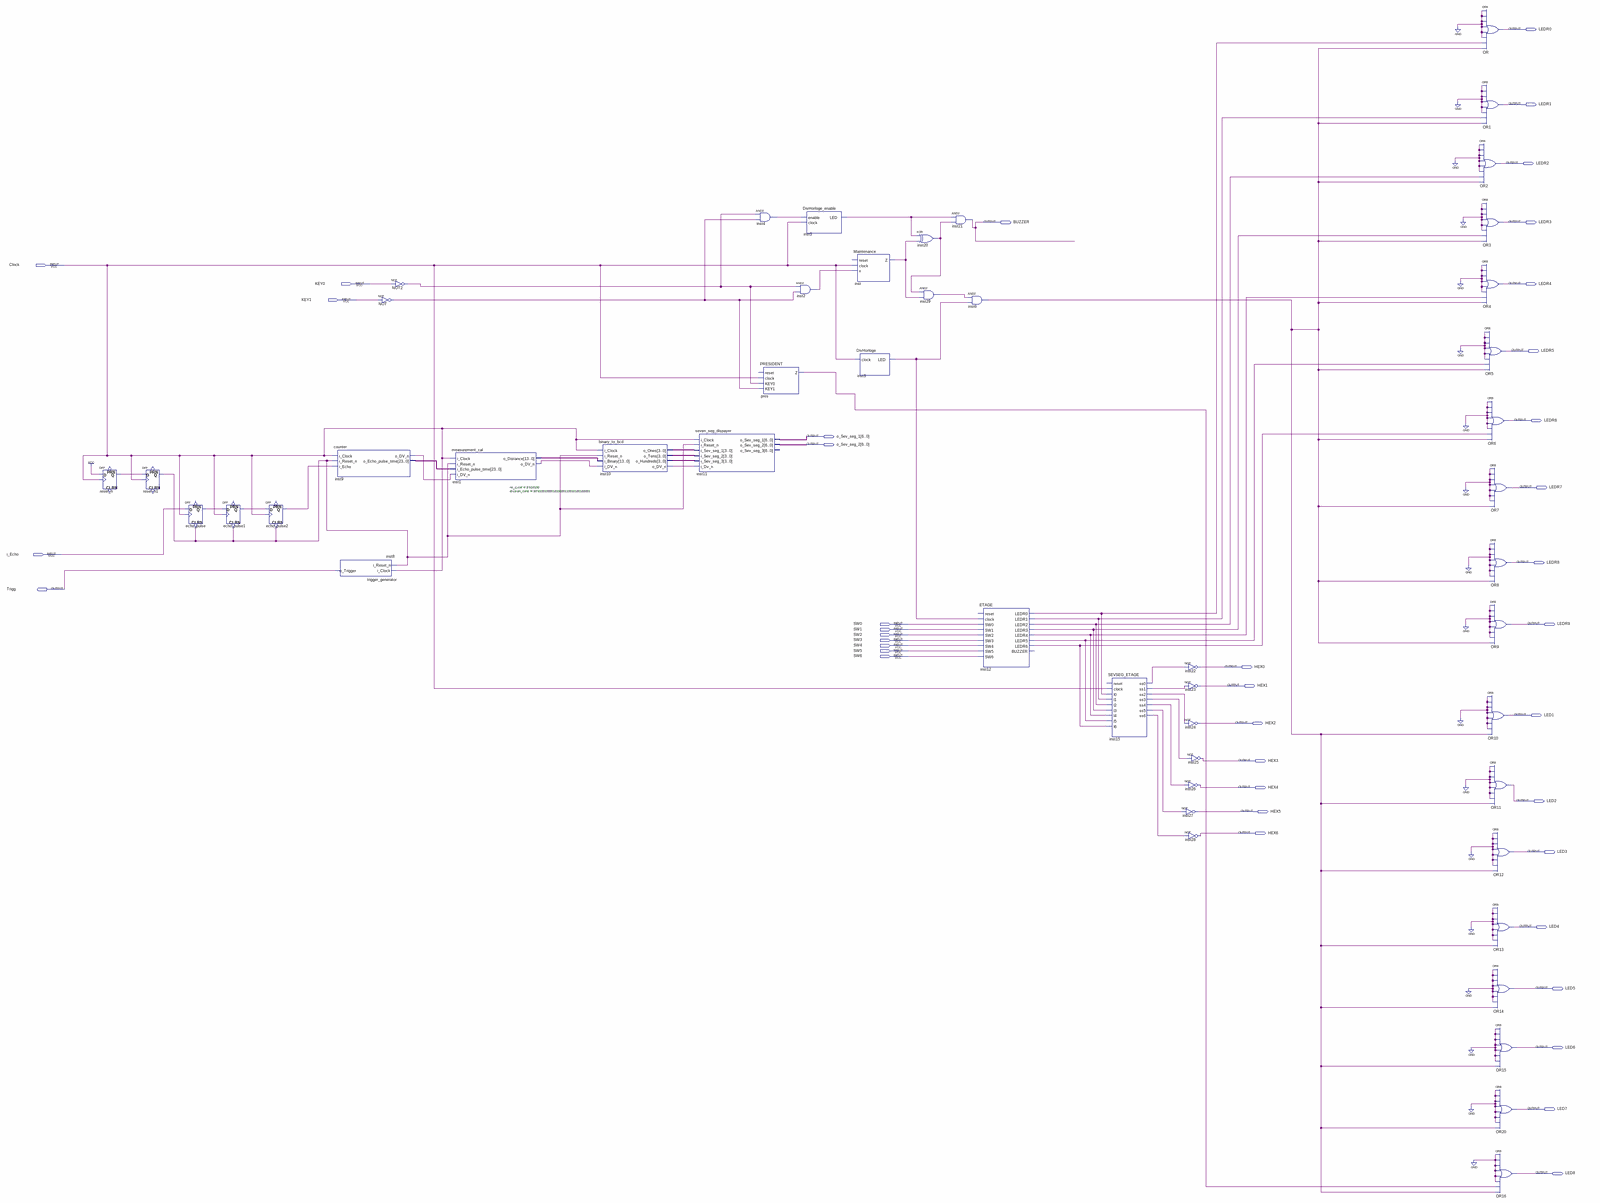
[diagram p0: schematic sheet, whole]
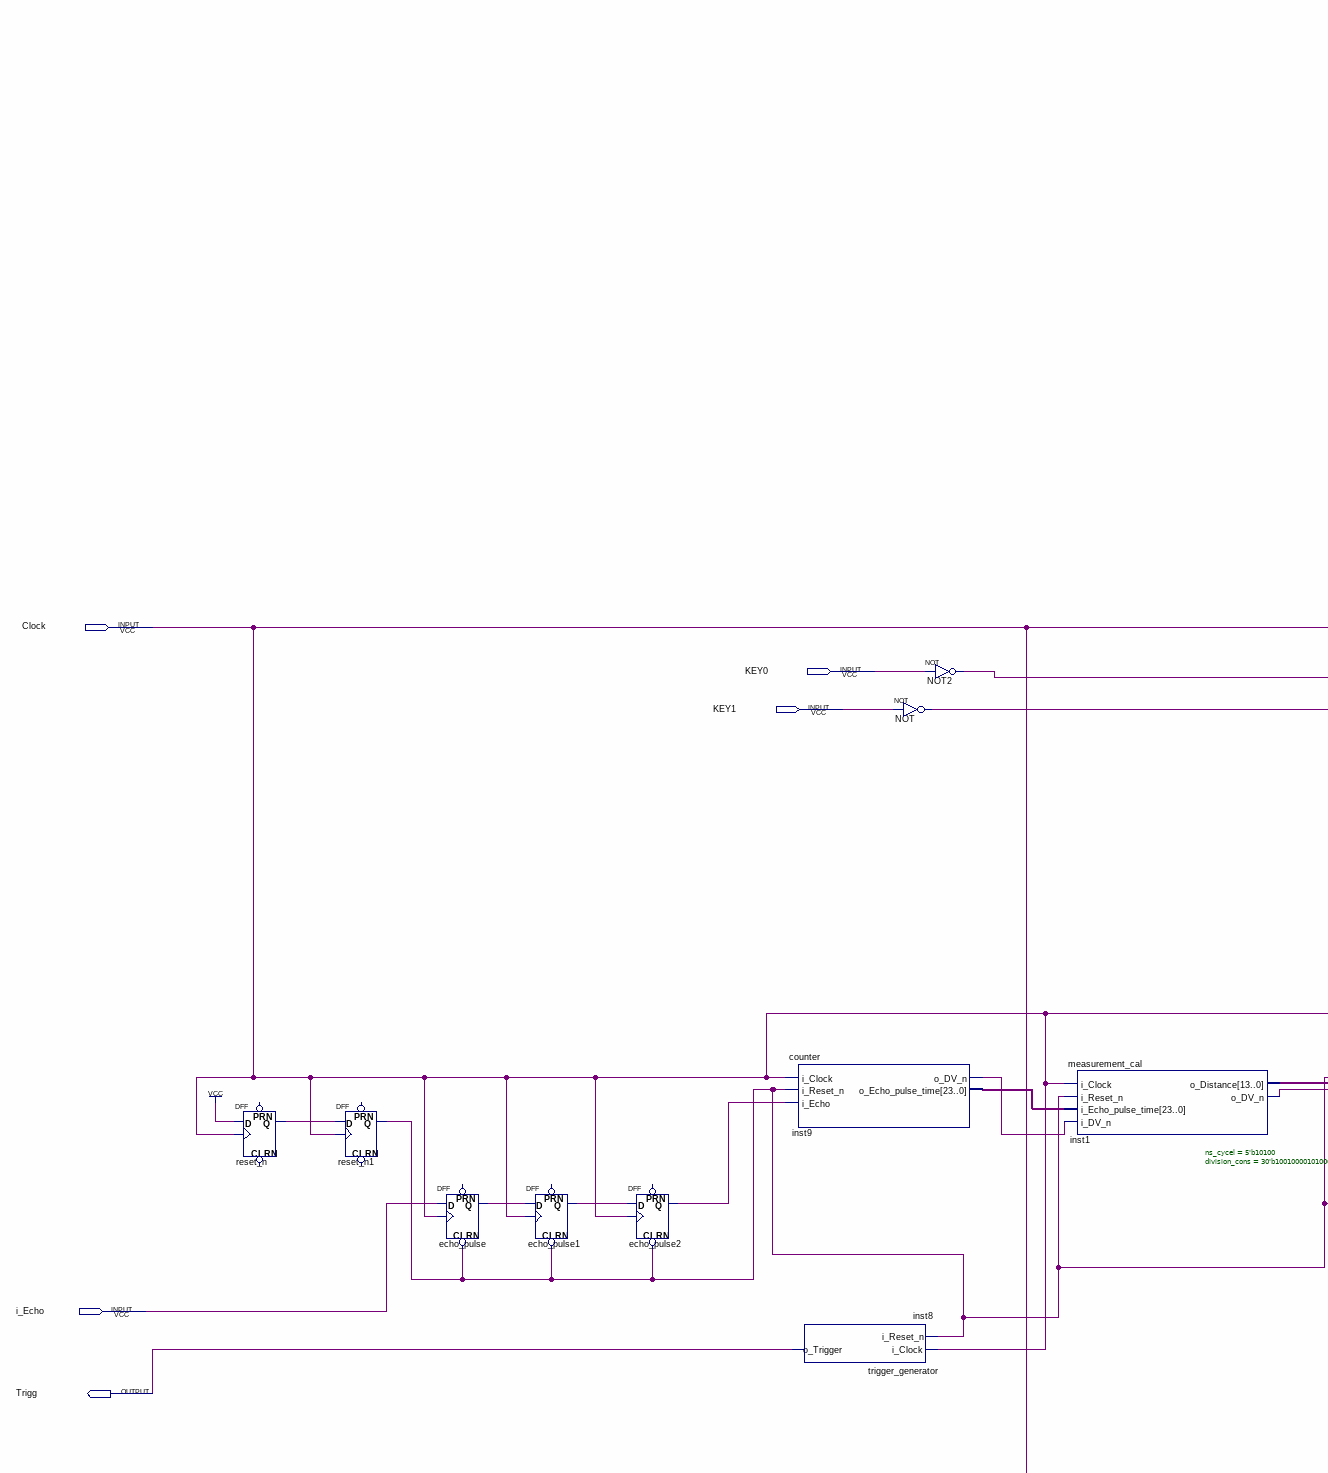
[diagram p1: schematic sheet, upper left part]
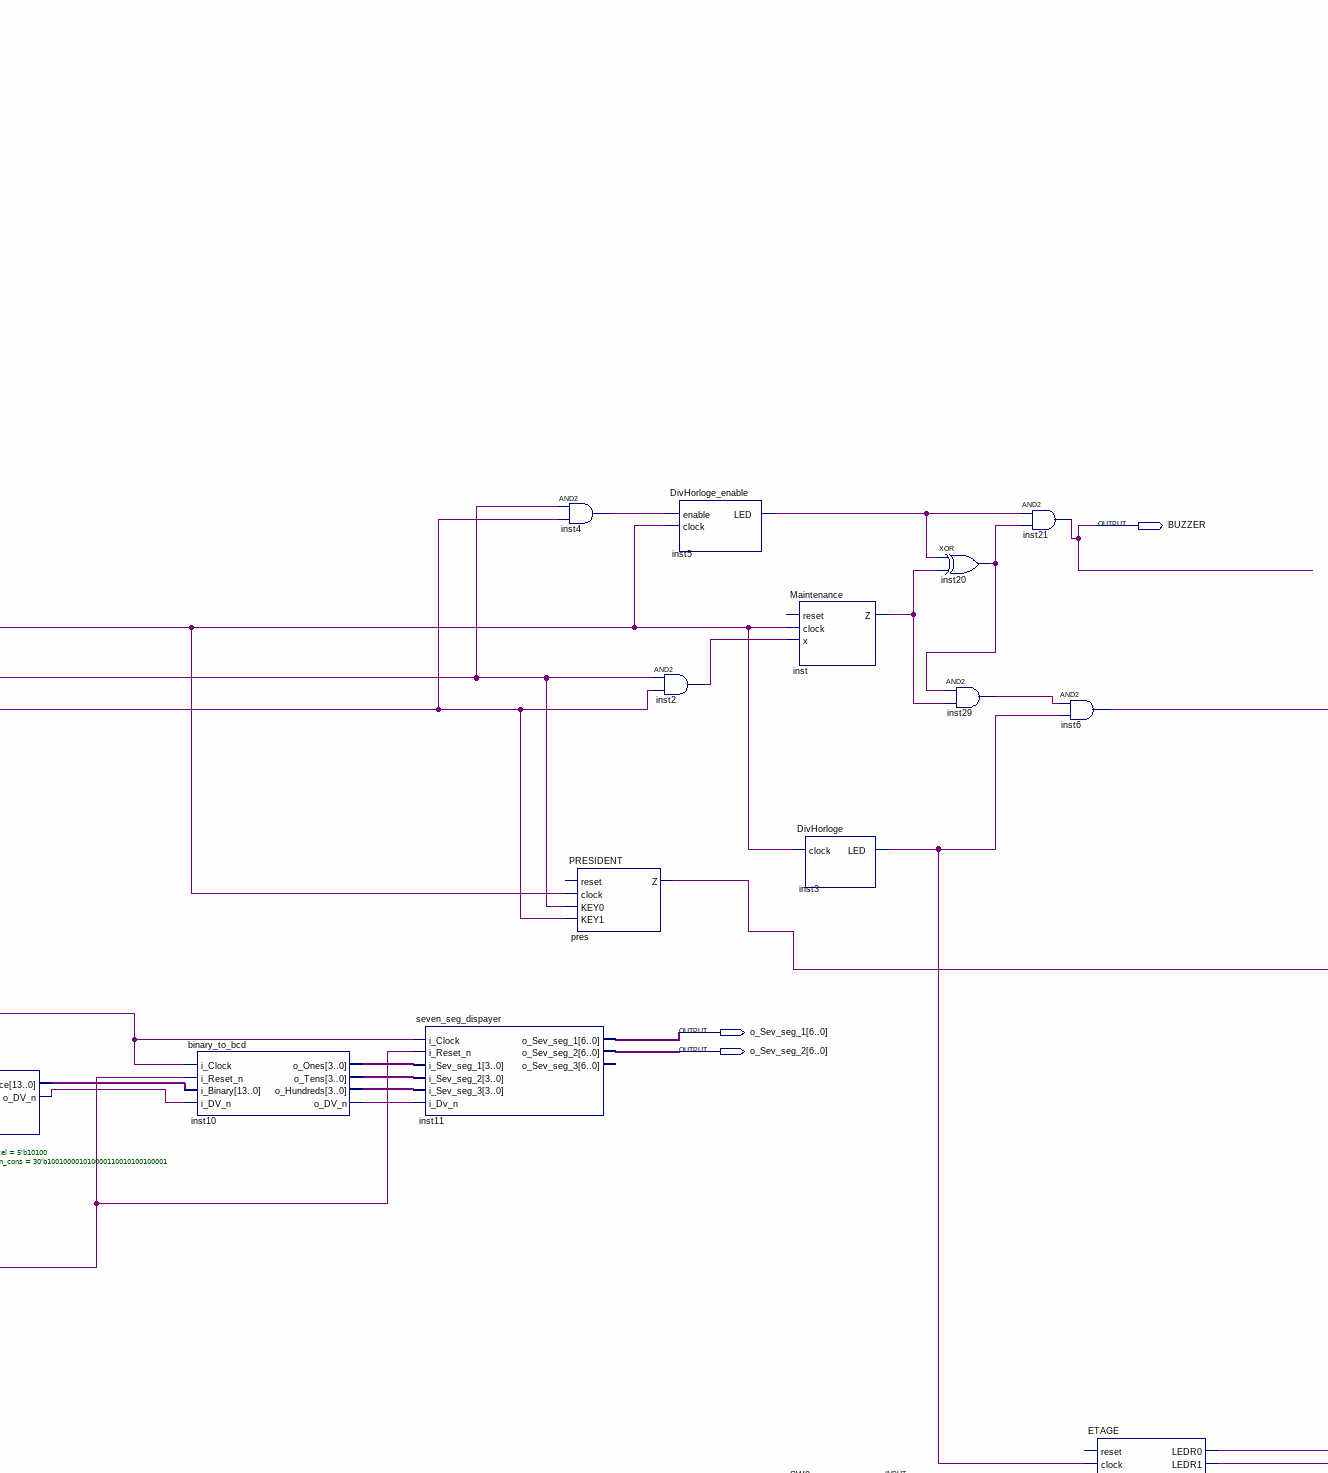
[diagram p2: schematic sheet, upper centre part]
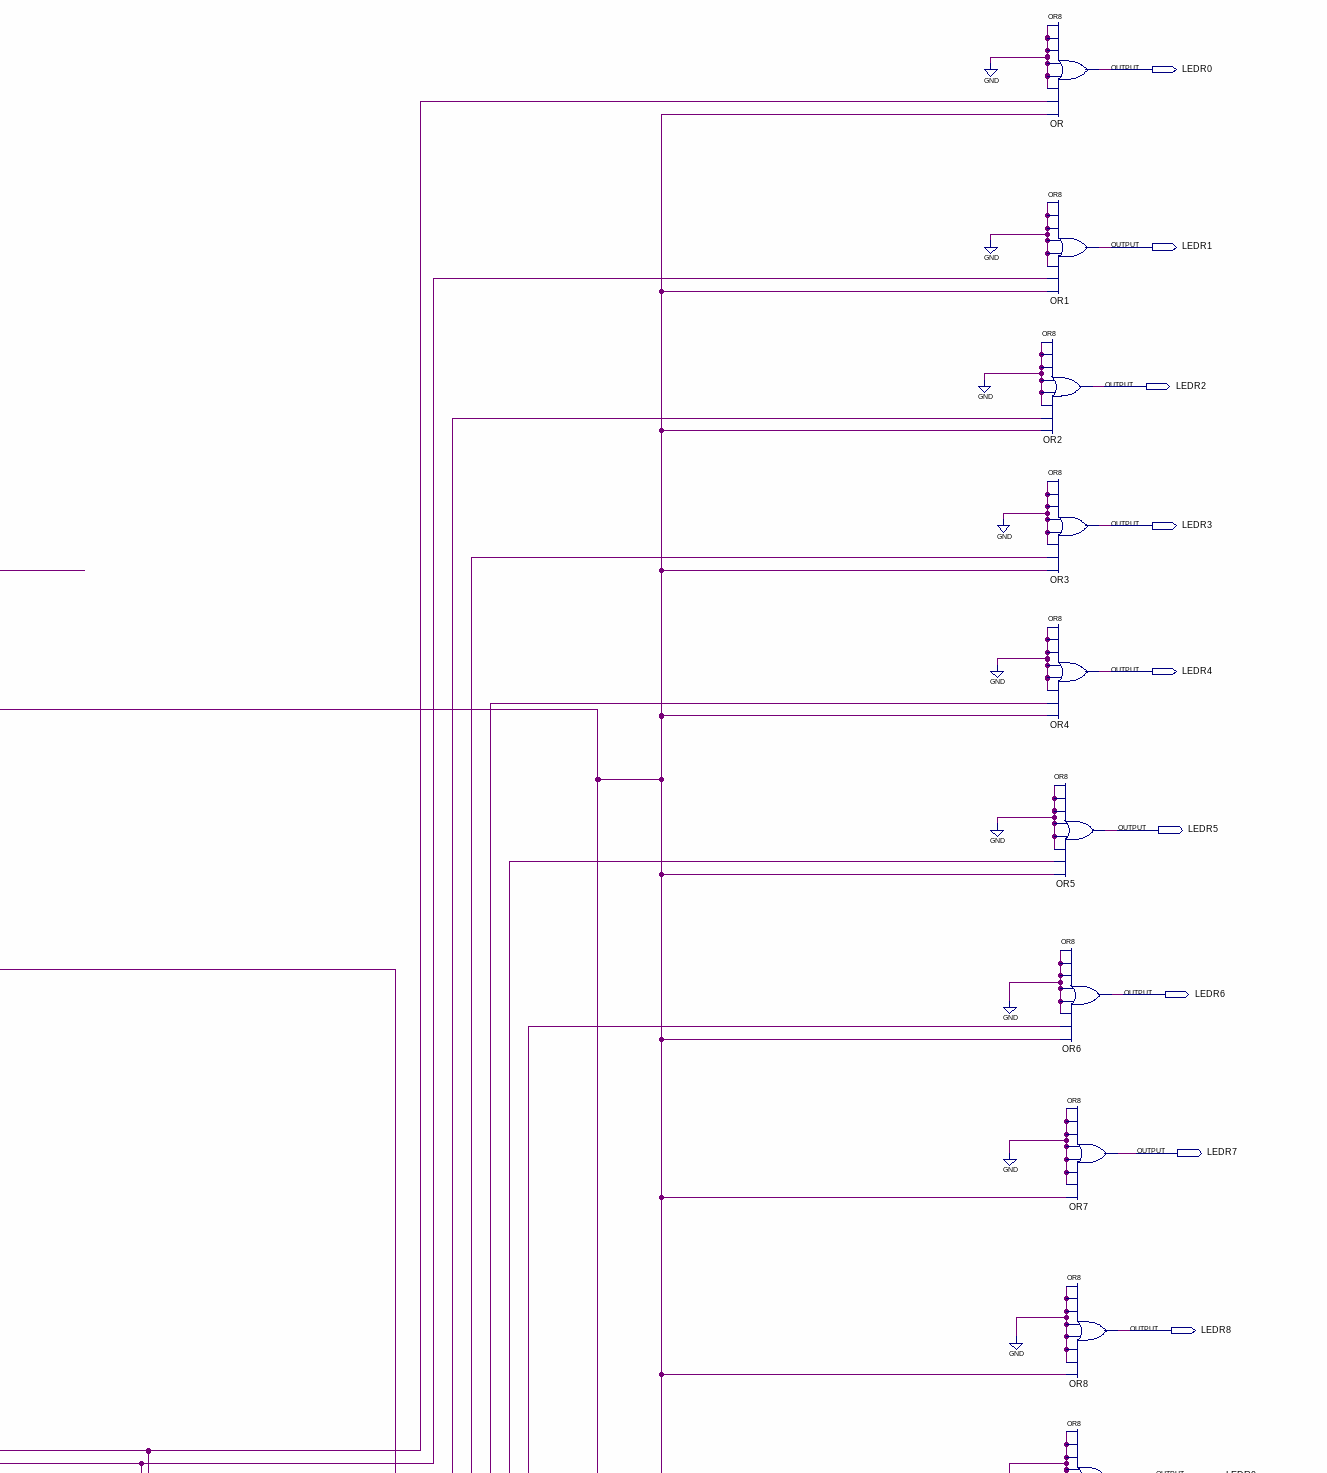
[diagram p3: schematic sheet, upper right part]
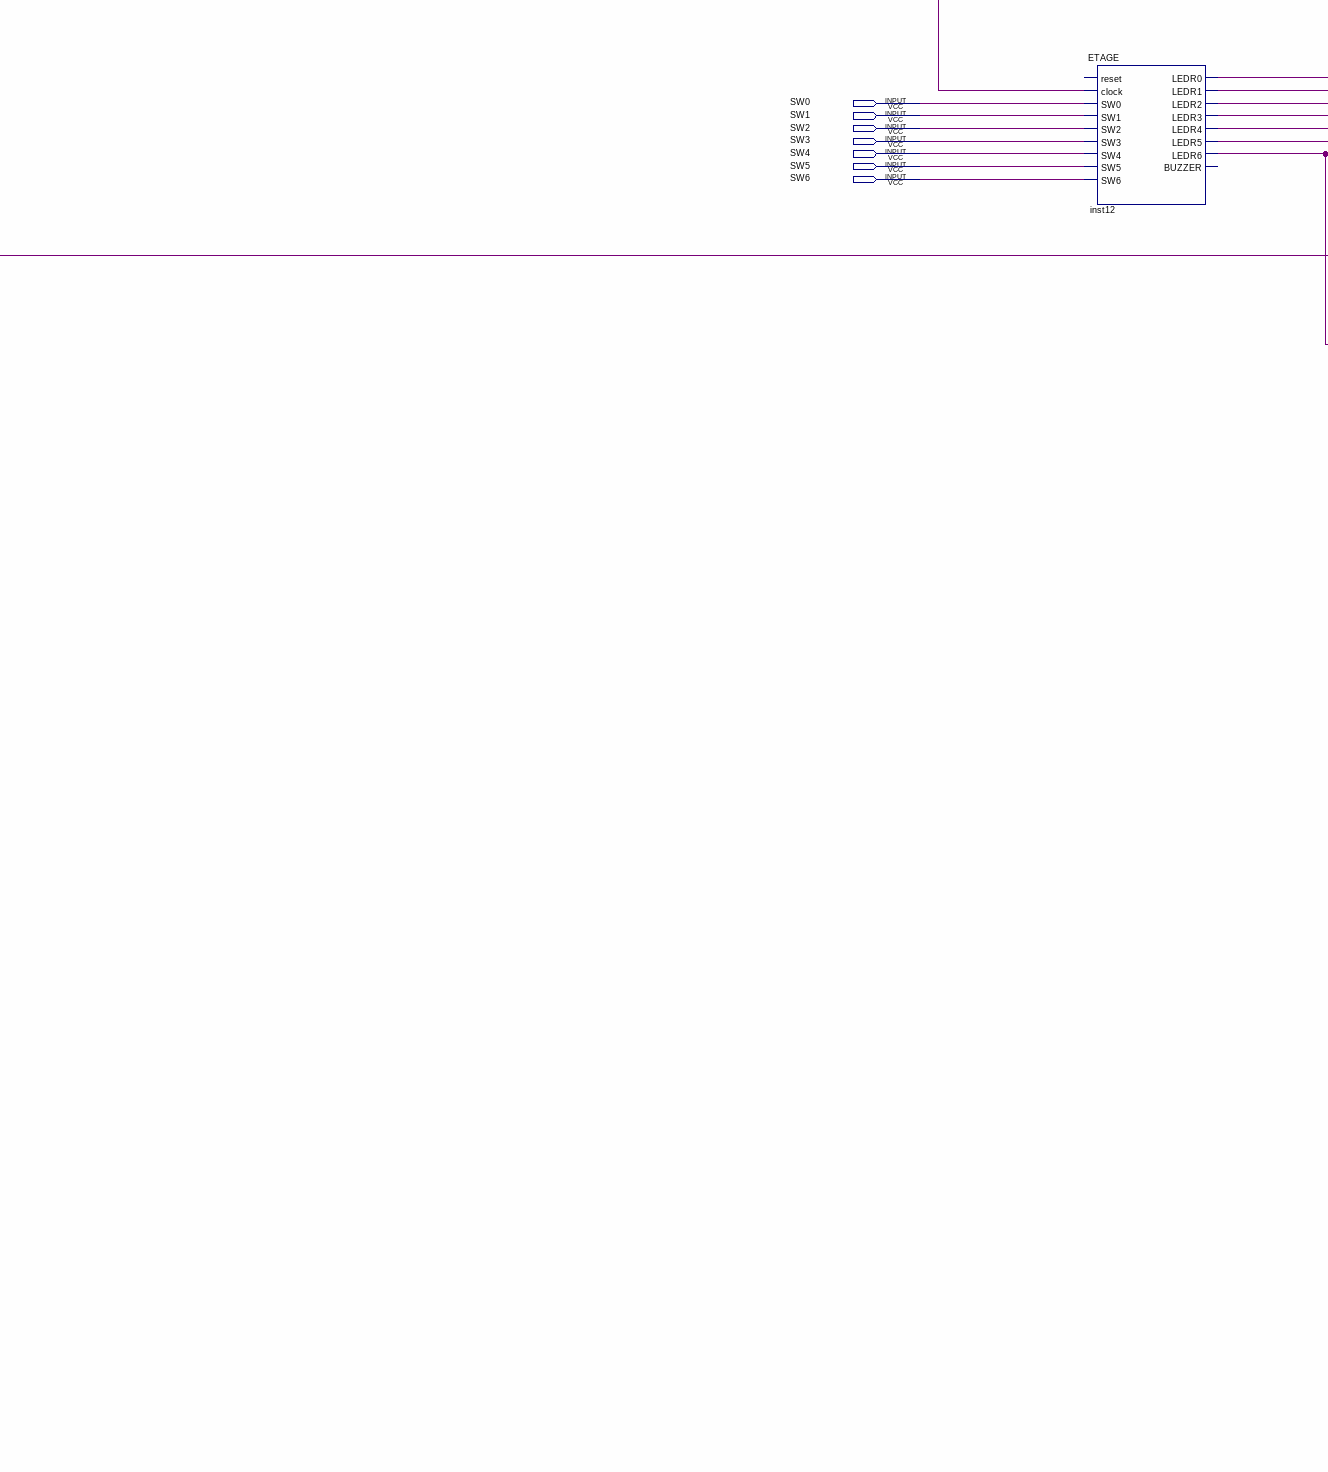
[diagram p4: schematic sheet, lower centre part]
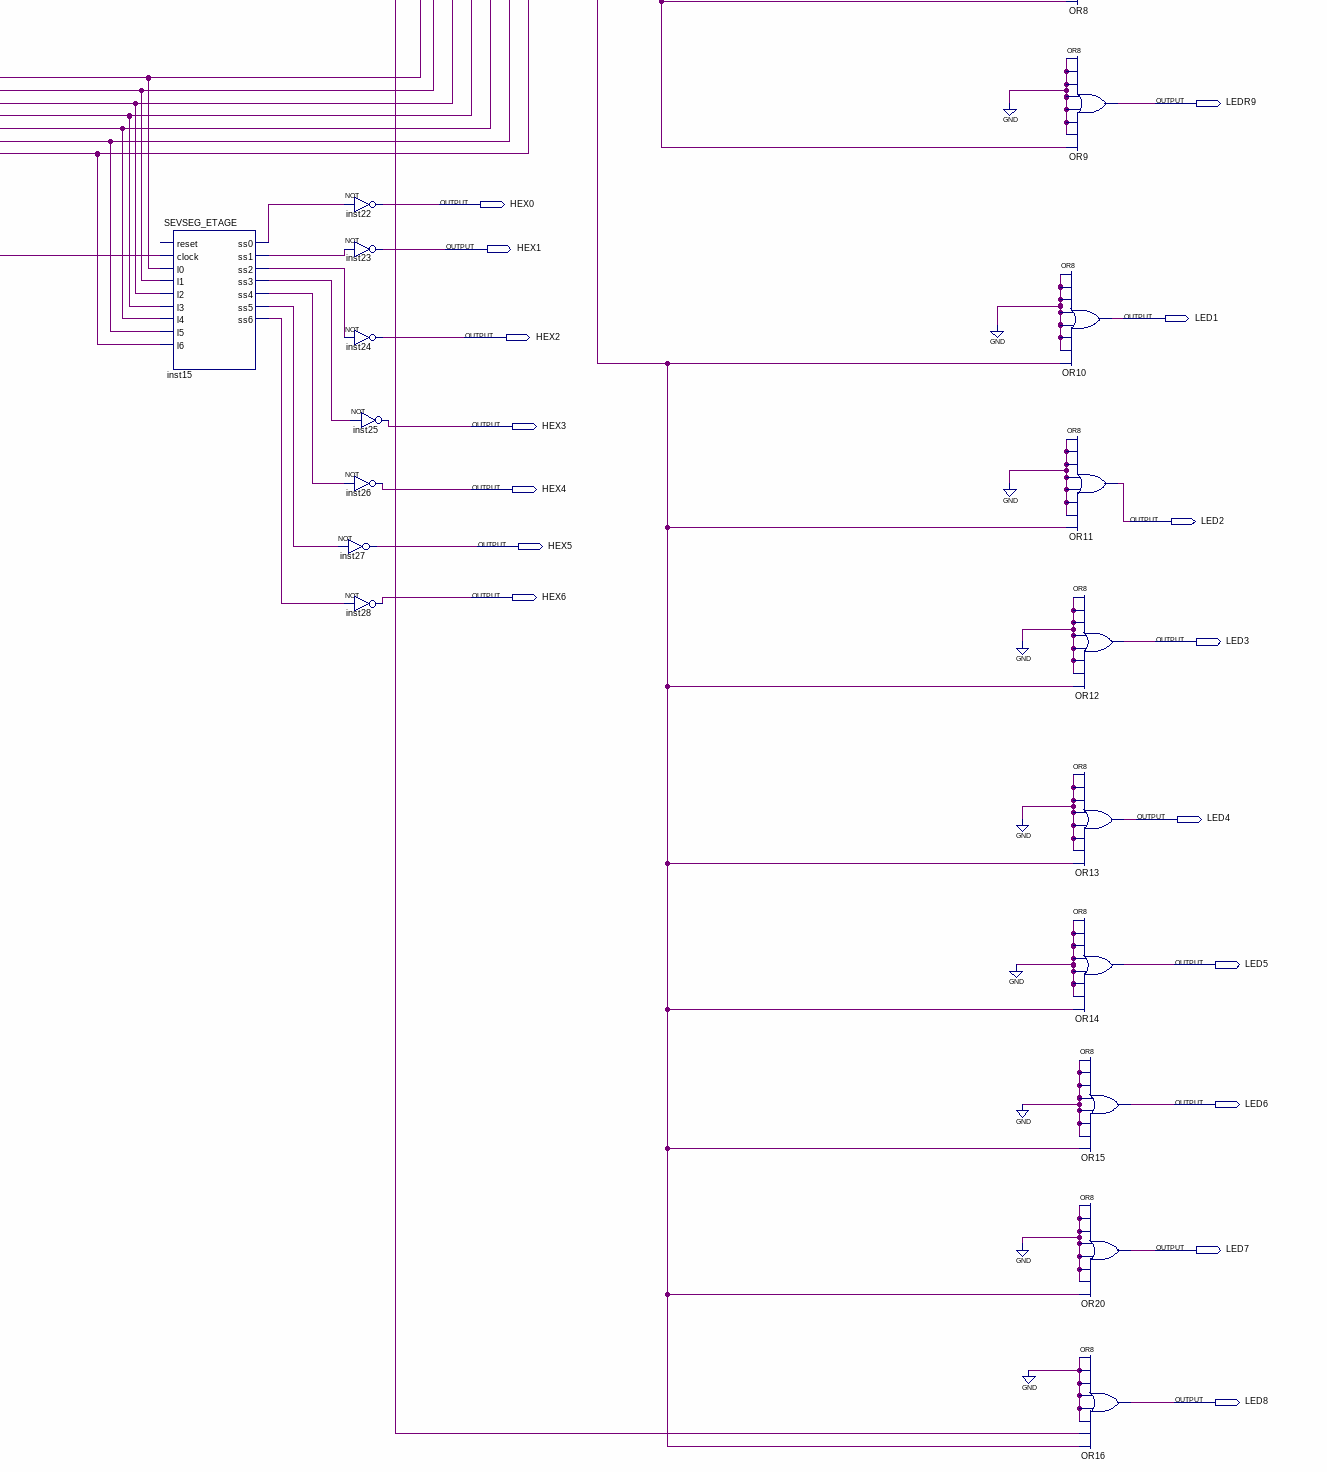
[diagram p5: schematic sheet, lower right part]
// Quartus schematic Quartus Robin.bdf as structural Verilog: 49 symbols, 40 pins
module \Quartus_Robin  (
  input  Clock,
  input  KEY0,
  input  KEY1,
  input  i_Echo,
  input  SW0,
  input  SW1,
  input  SW2,
  input  SW3,
  input  SW4,
  input  SW5,
  input  SW6,
  output LEDR0,
  output LEDR1,
  output LEDR2,
  output BUZZER,
  output LEDR3,
  output LEDR4,
  output LEDR5,
  output LEDR6,
  output [6:0] o_Sev_seg_1,
  output [6:0] o_Sev_seg_2,
  output LEDR7,
  output LEDR8,
  output Trigg,
  output LEDR9,
  output HEX0,
  output HEX1,
  output LED1,
  output HEX2,
  output HEX3,
  output HEX4,
  output LED2,
  output HEX5,
  output HEX6,
  output LED3,
  output LED4,
  output LED5,
  output LED6,
  output LED7,
  output LED8
);

  wire echo_pulse1_q, echo_pulse2_q, echo_pulse_q, inst1_o_dv_n, inst2_out, inst3_led, inst4_out, inst5_led,
       inst6_out, inst9_o_dv_n, inst10_o_dv_n, inst12_ledr0, inst12_ledr1, inst12_ledr2, inst12_ledr3,
       inst12_ledr4, inst12_ledr5, inst12_ledr6, inst15_ss0, inst15_ss1, inst15_ss2, inst15_ss3, inst15_ss4,
       inst15_ss5, inst15_ss6, inst20_out, inst29_out, inst_z, NOT2_out, NOT_out, pres_z, reset_n1_q,
       reset_n_q;
  wire [3:0] inst10_o_hundreds, inst10_o_ones, inst10_o_tens;
  wire [13:0] inst1_o_distance;
  wire [23:0] inst9_o_echo_pulse_time;

  DFF reset_n (.CLK(Clock), .D(1'b1), .Q(reset_n_q));  // open: CLRN, PRN
  DFF reset_n1 (.CLK(Clock), .D(reset_n_q), .Q(reset_n1_q));  // open: CLRN, PRN
  DFF echo_pulse (.CLRN(reset_n1_q), .CLK(Clock), .D(i_Echo), .Q(echo_pulse_q));  // open: PRN
  DFF echo_pulse1 (.CLRN(reset_n1_q), .CLK(Clock), .D(echo_pulse_q), .Q(echo_pulse1_q));  // open: PRN
  DFF echo_pulse2 (.CLRN(reset_n1_q), .CLK(Clock), .D(echo_pulse1_q), .Q(echo_pulse2_q));  // open: PRN
  counter inst9 (
    .i_Clock(Clock), .i_Reset_n(reset_n1_q), .i_Echo(echo_pulse2_q), .o_DV_n(inst9_o_dv_n),
    .o_Echo_pulse_time(inst9_o_echo_pulse_time));
  trigger_generator inst8 (.i_Clock(Clock), .i_Reset_n(reset_n1_q), .o_Trigger(Trigg));
  not NOT (NOT_out, KEY1);
  not NOT2 (NOT2_out, KEY0);
  measurement_cal #(.ns_cycel(5'b10100), .division_cons(30'b100100001010000110010100100001)) inst1 (
    .i_Clock(Clock), .i_Reset_n(reset_n1_q), .i_Echo_pulse_time(inst9_o_echo_pulse_time),
    .i_DV_n(inst9_o_dv_n), .o_Distance(inst1_o_distance), .o_DV_n(inst1_o_dv_n));
  binary_to_bcd inst10 (
    .i_Clock(Clock), .i_Reset_n(reset_n1_q), .i_Binary(inst1_o_distance), .i_DV_n(inst1_o_dv_n),
    .o_Ones(inst10_o_ones), .o_Tens(inst10_o_tens), .o_Hundreds(inst10_o_hundreds), .o_DV_n(inst10_o_dv_n));
  seven_seg_dispayer inst11 (
    .i_Clock(Clock), .i_Reset_n(reset_n1_q), .i_Sev_seg_1(inst10_o_ones), .i_Sev_seg_2(inst10_o_tens),
    .i_Sev_seg_3(inst10_o_hundreds), .i_Dv_n(inst10_o_dv_n), .o_Sev_seg_1(o_Sev_seg_1),
    .o_Sev_seg_2(o_Sev_seg_2));  // open: o_Sev_seg_3
  and inst4 (inst4_out, NOT2_out, NOT_out);
  PRESIDENT pres (.clock(Clock), .KEY0(NOT2_out), .KEY1(NOT_out), .Z(pres_z));  // open: reset
  DivHorloge_enable inst5 (.enable(inst4_out), .clock(Clock), .LED(inst5_led));
  and inst2 (inst2_out, NOT2_out, NOT_out);
  Maintenance inst (.clock(Clock), .x(inst2_out), .Z(inst_z));  // open: reset
  DivHorloge inst3 (.clock(Clock), .LED(inst3_led));
  xor inst20 (inst20_out, inst5_led, inst_z);
  and inst29 (inst29_out, inst20_out, inst_z);
  and inst21 (BUZZER, inst5_led, inst20_out);
  and inst6 (inst6_out, inst29_out, inst3_led);
  ETAGE inst12 (
    .clock(inst3_led), .SW0(SW0), .SW1(SW1), .SW2(SW2), .SW3(SW3), .SW4(SW4), .SW5(SW5), .SW6(SW6),
    .LEDR0(inst12_ledr0), .LEDR1(inst12_ledr1), .LEDR2(inst12_ledr2), .LEDR3(inst12_ledr3),
    .LEDR4(inst12_ledr4), .LEDR5(inst12_ledr5), .LEDR6(inst12_ledr6));  // open: reset, BUZZER
  SEVSEG_ETAGE inst15 (
    .clock(Clock), .l0(inst12_ledr0), .l1(inst12_ledr1), .l2(inst12_ledr2), .l3(inst12_ledr3),
    .l4(inst12_ledr4), .l5(inst12_ledr5), .l6(inst12_ledr6), .ss0(inst15_ss0), .ss1(inst15_ss1),
    .ss2(inst15_ss2), .ss3(inst15_ss3), .ss4(inst15_ss4), .ss5(inst15_ss5), .ss6(inst15_ss6));  // open: reset
  not inst22 (HEX0, inst15_ss0);
  not inst23 (HEX1, inst15_ss1);
  not inst24 (HEX2, inst15_ss2);
  not inst25 (HEX3, inst15_ss3);
  not inst26 (HEX4, inst15_ss4);
  not inst27 (HEX5, inst15_ss5);
  not inst28 (HEX6, inst15_ss6);
  or OR (LEDR0, 1'b0, 1'b0, 1'b0, 1'b0, 1'b0, 1'b0, inst12_ledr0, inst6_out);
  or OR1 (LEDR1, 1'b0, 1'b0, 1'b0, 1'b0, 1'b0, 1'b0, inst12_ledr1, inst6_out);
  or OR2 (LEDR2, 1'b0, 1'b0, 1'b0, 1'b0, 1'b0, 1'b0, inst12_ledr2, inst6_out);
  or OR3 (LEDR3, 1'b0, 1'b0, 1'b0, 1'b0, 1'b0, 1'b0, inst12_ledr3, inst6_out);
  or OR4 (LEDR4, 1'b0, 1'b0, 1'b0, 1'b0, 1'b0, 1'b0, inst12_ledr4, inst6_out);
  or OR5 (LEDR5, 1'b0, 1'b0, 1'b0, 1'b0, 1'b0, 1'b0, inst12_ledr5, inst6_out);
  or OR6 (LEDR6, 1'b0, 1'b0, 1'b0, 1'b0, 1'b0, 1'b0, inst12_ledr6, inst6_out);
  or OR7 (LEDR7, 1'b0, 1'b0, 1'b0, 1'b0, 1'b0, 1'b0, 1'b0, inst6_out);
  or OR8 (LEDR8, 1'b0, 1'b0, 1'b0, 1'b0, 1'b0, 1'b0, 1'b0, inst6_out);
  or OR9 (LEDR9, 1'b0, 1'b0, 1'b0, 1'b0, 1'b0, 1'b0, 1'b0, inst6_out);
  or OR10 (LED1, 1'b0, 1'b0, 1'b0, 1'b0, 1'b0, 1'b0, 1'b0, inst6_out);
  or OR11 (LED2, 1'b0, 1'b0, 1'b0, 1'b0, 1'b0, 1'b0, 1'b0, inst6_out);
  or OR12 (LED3, 1'b0, 1'b0, 1'b0, 1'b0, 1'b0, 1'b0, 1'b0, inst6_out);
  or OR13 (LED4, 1'b0, 1'b0, 1'b0, 1'b0, 1'b0, 1'b0, 1'b0, inst6_out);
  or OR14 (LED5, 1'b0, 1'b0, 1'b0, 1'b0, 1'b0, 1'b0, 1'b0, inst6_out);
  or OR15 (LED6, 1'b0, 1'b0, 1'b0, 1'b0, 1'b0, 1'b0, 1'b0, inst6_out);
  or OR20 (LED7, 1'b0, 1'b0, 1'b0, 1'b0, 1'b0, 1'b0, 1'b0, inst6_out);
  or OR16 (LED8, 1'b0, 1'b0, 1'b0, 1'b0, 1'b0, 1'b0, pres_z, inst6_out);
endmodule
